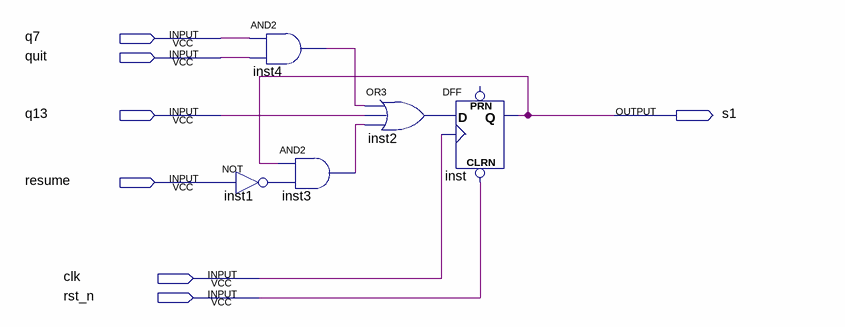
[diagram p0: schematic sheet]
// Quartus schematic s1.bdf as structural Verilog: 5 symbols, 7 pins
module s1 (
  input  q7,
  input  quit,
  input  q13,
  input  resume,
  input  clk,
  input  rst_n,
  output s1
);

  wire inst1_out, inst2_out, inst3_out, inst4_out;

  and inst4 (inst4_out, q7, quit);
  not inst1 (inst1_out, resume);
  and inst3 (inst3_out, s1, inst1_out);
  or inst2 (inst2_out, inst4_out, q13, inst3_out);
  DFF inst (.CLRN(rst_n), .CLK(clk), .D(inst2_out), .Q(s1));  // open: PRN
endmodule
